# EAGLE schematic PX4IOARMTv1.0 (EAGLE 6.2)
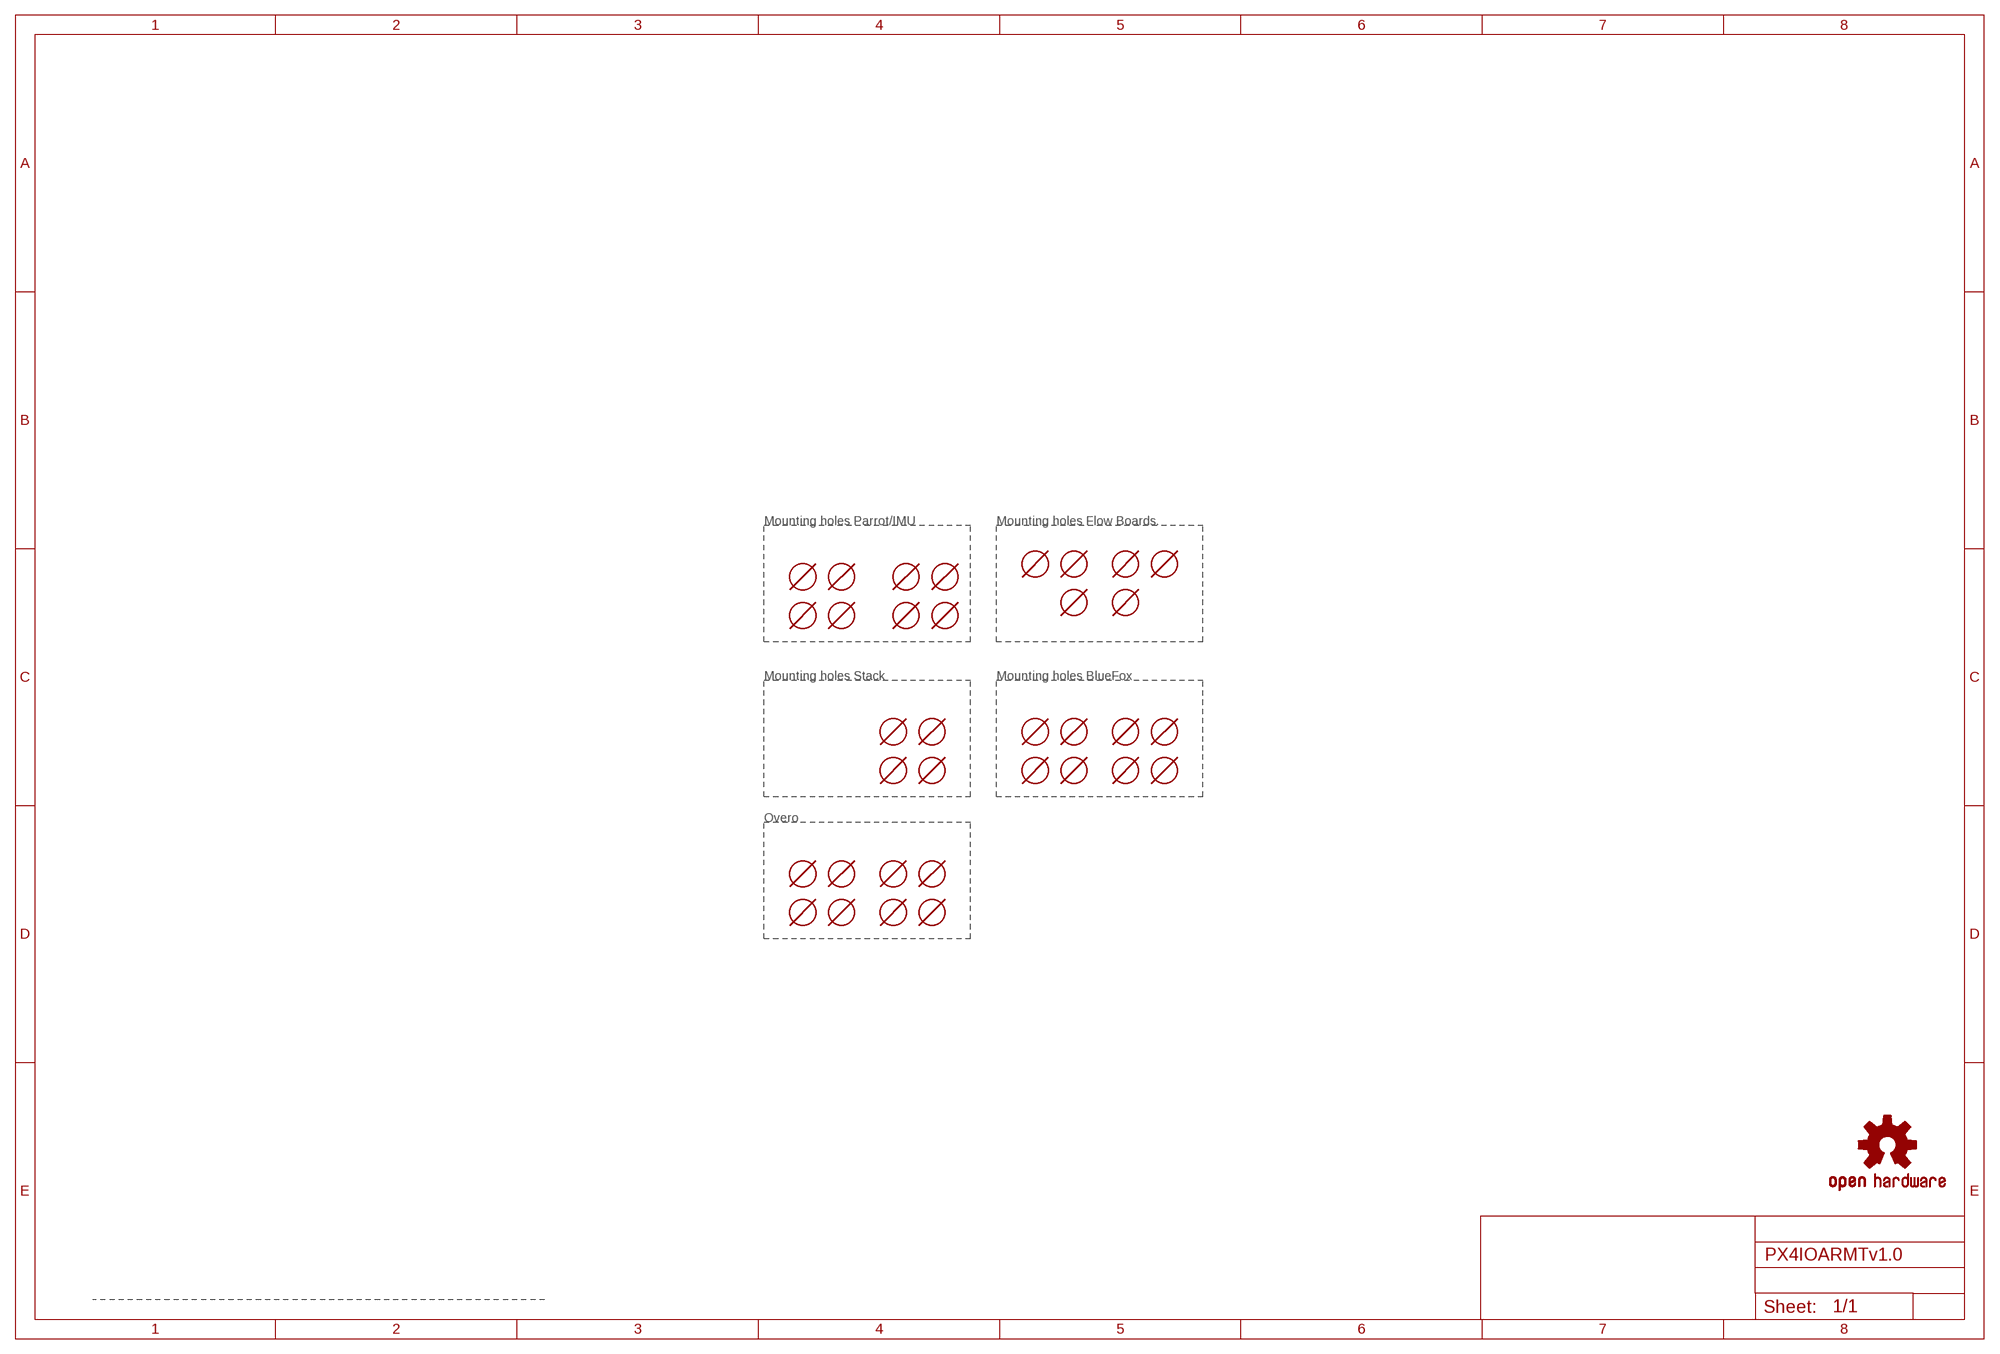
[diagram p0: schematic, sheet 1]

## Parts
U$1  MOUNT-HOLE2.6MM  [MOUNT-HOLE2.6]
U$2  MOUNT-HOLE2.6MM  [MOUNT-HOLE2.6]
U$3  MOUNT-HOLE2.6MM  [MOUNT-HOLE2.6]
U$4  MOUNT-HOLE3.1MM  [MOUNT-HOLE3.1]
U$5  MOUNT-HOLE3.1MM  [MOUNT-HOLE3.1]
U$6  MOUNT-HOLE3.1MM  [MOUNT-HOLE3.1]
U$7  MOUNT-HOLE3.1MM  [MOUNT-HOLE3.1]
U$8  MOUNT-HOLE2.6MM  [MOUNT-HOLE2.6]
U$9  OSHW-LOGOM  [OSHW-LOGO-M]
U$10  MOUNT-HOLE2.6MM  [MOUNT-HOLE2.6]
U$11  MOUNT-HOLE3.1MM  [MOUNT-HOLE3.1]
U$12  MOUNT-HOLE3.1MM  [MOUNT-HOLE3.1]
U$13  MOUNT-HOLE2.6MM  [MOUNT-HOLE2.6]
U$14  MOUNT-HOLE2.6MM  [MOUNT-HOLE2.6]
U$15  MOUNT-HOLE2.1MM  [MOUNT-HOLE2.1]
U$16  MOUNT-HOLE2.6MM  [MOUNT-HOLE2.6]
U$17  MOUNT-HOLE2.6MM  [MOUNT-HOLE2.6]
U$18  MOUNT-HOLE2.1MM  [MOUNT-HOLE2.1]
U$19  MOUNT-HOLE2.6MM  [MOUNT-HOLE2.6]
U$20  MOUNT-HOLE2.1MM  [MOUNT-HOLE2.1]
U$21  MOUNT-HOLE3.1MM  [MOUNT-HOLE3.1]
U$22  MOUNT-HOLE2.1MM  [MOUNT-HOLE2.1]
U$23  MOUNT-HOLE2.6MM  [MOUNT-HOLE2.6]
U$24  MOUNT-HOLE2.6MM  [MOUNT-HOLE2.6]
U$29  MOUNT-HOLE2.6MM  [MOUNT-HOLE2.6]
U$30  MOUNT-HOLE2.6MM  [MOUNT-HOLE2.6]
U$31  MOUNT-HOLE2.6MM  [MOUNT-HOLE2.6]
U$32  MOUNT-HOLE2.6MM  [MOUNT-HOLE2.6]
U$33  MOUNT-HOLE2.6MM  [MOUNT-HOLE2.6]
U$34  MOUNT-HOLE2.6MM  [MOUNT-HOLE2.6]
U$40  MOUNT-HOLE3.1MM  [MOUNT-HOLE3.1]
U$43  MOUNT-HOLE3.1MM  [MOUNT-HOLE3.1]
U$44  MOUNT-HOLE3.1MM  [MOUNT-HOLE3.1]
U$45  MOUNT-HOLE3.1MM  [MOUNT-HOLE3.1]
U$46  MOUNT-HOLE3.1MM  [MOUNT-HOLE3.1]

## Notes on the sheet
- Mounting holes Parrot/IMU | Mounting holes Flow Boards.
- Mounting holes Stack | Mounting holes BlueFox
- Overo

## Library data of the parts
U$1-U$8 U$10-U$24 U$29-U$34 U$40 U$43-U$46 = pixhawk2:MOUNT-HOLE; BOM: EXCLUDE
U$9 = pixhawk2:OSHW-LOGO: Open Source Hardware Logo This logo indicates the piece of hardware it is found on incorporates a OSHW license and/or adheres to the definition of open source hardware found here: http://freedomdefined.org/OSHW; BOM: EXCLUDE

## Net classes
0 signal: width 0.203 mm, drill 0.3 mm, clearance 0.203 mm
1 power: width 0.254 mm, drill 0.3 mm, clearance 0.203 mm